# Altium schematic sheet RPi-HAT_Conn-EE.SchDoc: Raspberry Pi HAT Template
size A4; DrawnBy: Jonas Lorander; Organization: Jonas Lorander; Address1: jonas@lorander.com; Address2: Stockholm, Sweden; Address3: http://jonas.lorander.com/; DocumentNumber: -; Revision: PA1; SheetNumber: 2; SheetTotal: 12
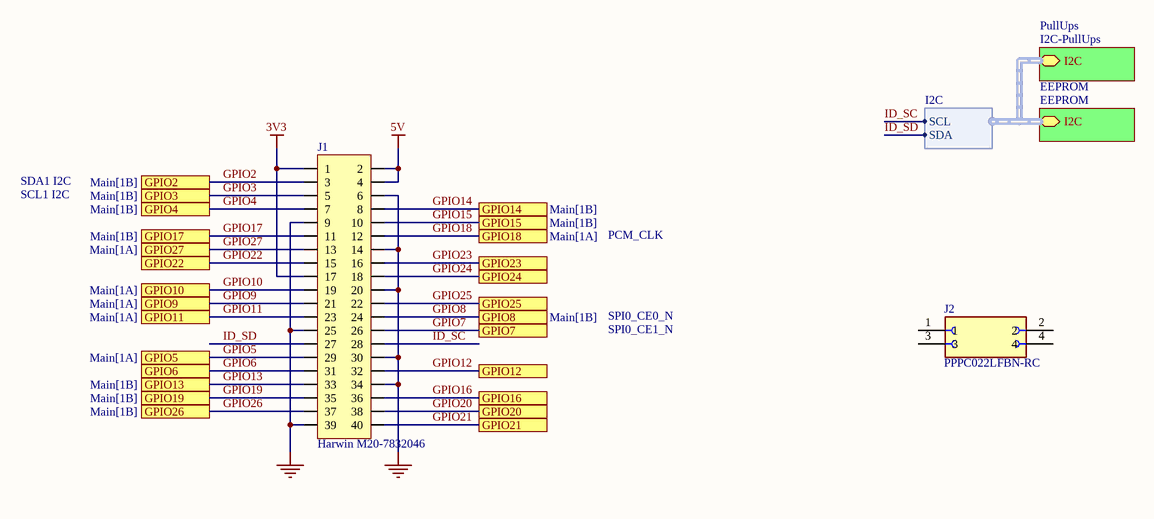
[diagram p0: RPi-HAT_Conn-EE.SchDoc]

## Parts
J1  Harwin M20-7832046  [PCB-677180-1]
J2  PPPC022LFBN-RC  [SULLINS_PPPC022LFBN-RC]

## Sub-sheets
EEPROM = EEPROM: I2C (bidir, harness I2C)
PullUps = I2C-PullUps: I2C (bidir, harness I2C)

## Ports
GPIO2 (see Main[1B]), GPIO3 (see Main[1B]), GPIO4 (see Main[1B]), GPIO5 (see Main[1A]), GPIO6, GPIO7, GPIO8 (see Main[1B]), GPIO9 (see Main[1A]), GPIO10 (see Main[1A]), GPIO11 (see Main[1A]), GPIO12, GPIO13 (see Main[1B]), GPIO14 (see Main[1B]), GPIO15 (see Main[1B]), GPIO16, GPIO17 (see Main[1B]), GPIO18 (see Main[1A]), GPIO19 (see Main[1B]), GPIO20, GPIO21, GPIO22, GPIO23, GPIO24, GPIO25, GPIO26 (see Main[1B]), GPIO27 (see Main[1A])

## Harnesses
I2C: SCL, SDA

## Nets
3V3: J1.1 J1.17
5V: J1.2 J1.4
GND: J1.6 J1.9 J1.14 J1.20 J1.25 J1.30 J1.34 J1.39
GPIO2: J1.3 ; port GPIO2
GPIO3: J1.5 ; port GPIO3
GPIO4: J1.7 ; port GPIO4
GPIO5: J1.29 ; port GPIO5
GPIO6: J1.31 ; port GPIO6
GPIO7: J1.26 ; port GPIO7
GPIO8: J1.24 ; port GPIO8
GPIO9: J1.21 ; port GPIO9
GPIO10: J1.19 ; port GPIO10
GPIO11: J1.23 ; port GPIO11
GPIO12: J1.32 ; port GPIO12
GPIO13: J1.33 ; port GPIO13
GPIO14: J1.8 ; port GPIO14
GPIO15: J1.10 ; port GPIO15
GPIO16: J1.36 ; port GPIO16
GPIO17: J1.11 ; port GPIO17
GPIO18: J1.12 ; port GPIO18
GPIO19: J1.35 ; port GPIO19
GPIO20: J1.38 ; port GPIO20
GPIO21: J1.40 ; port GPIO21
GPIO22: J1.15 ; port GPIO22
GPIO23: J1.16 ; port GPIO23
GPIO24: J1.18 ; port GPIO24
GPIO25: J1.22 ; port GPIO25
GPIO26: J1.37 ; port GPIO26
GPIO27: J1.13 ; port GPIO27
ID_SC: J1.28 ; sheet EEPROM/I2C.SCL
ID_SD: J1.27 ; sheet EEPROM/I2C.SDA

Not connected (* = marked no-connect by the designer): J2 1 2 3 4

## Buses and harness runs
harness sheet EEPROM/I2C = sheet PullUps/I2C

## Notes on the sheet
- SDA1 I2C
- SCL1 I2C
- PCM_CLK
- SPI0_CE0_N
- SPI0_CE1_N
- Title
- Size:
- Date:
- A4
- Number:
- Time:
- Revision:
- Sheet
- of
- File:

## Library data of the parts
J1 = CMP-2482621-3: Headers & Wire Housings 20+20 DIL VERTICAL SOCKET TIN; Contact Resistance: 0.015 Ω; Current Rating: 3.0 A; Gender: Female; Insulation Resistance: 1000000.0 Ω; Number of Contacts: 40; Number of Mating Cycles: 50; Pin Pitch: 0.00254 m; Color: Black; Contact Material: Phosphor Bronze; Contact Plating: Tin; Material: Polyester; Number of Rows: 2; Octopart Url: https://octopart.com/m20-7832046-harwin-5372736; OctopartID: 2d85e4def3a3f242; REACH SVHC Compliance: No SVHC; RoHS: Compliant
J2 = CMP-026-000000-1: 4 Position Header Connector 0.100 (2.54mm) Through Hole Gold; MF: Sullins Connector Solutions; SnapEDA_Link: https://www.snapeda.com/parts/PPPC022LFBN-RC/Sullins+Connector+Solutions/view-part/?ref=snap; Price: None; Purchase-URL: https://pricing.snapeda.com/search/part/PPPC022LFBN-RC/?ref=eda; Availability: In Stock; Pin Count: 4; Source: PPPC022LFBN-RC.SchLib; Design Item ID: PPPC022LFBN-RC; Value: *; Package: None; Component Type: Standard; Check_prices: https://www.snapeda.com/parts/PPPC022LFBN-RC/Sullins+Connector+Solutions/view-part/?ref=eda; MP: PPPC022LFBN-RC